# EAGLE schematic CANFD_HUB (EAGLE 9.6.2)
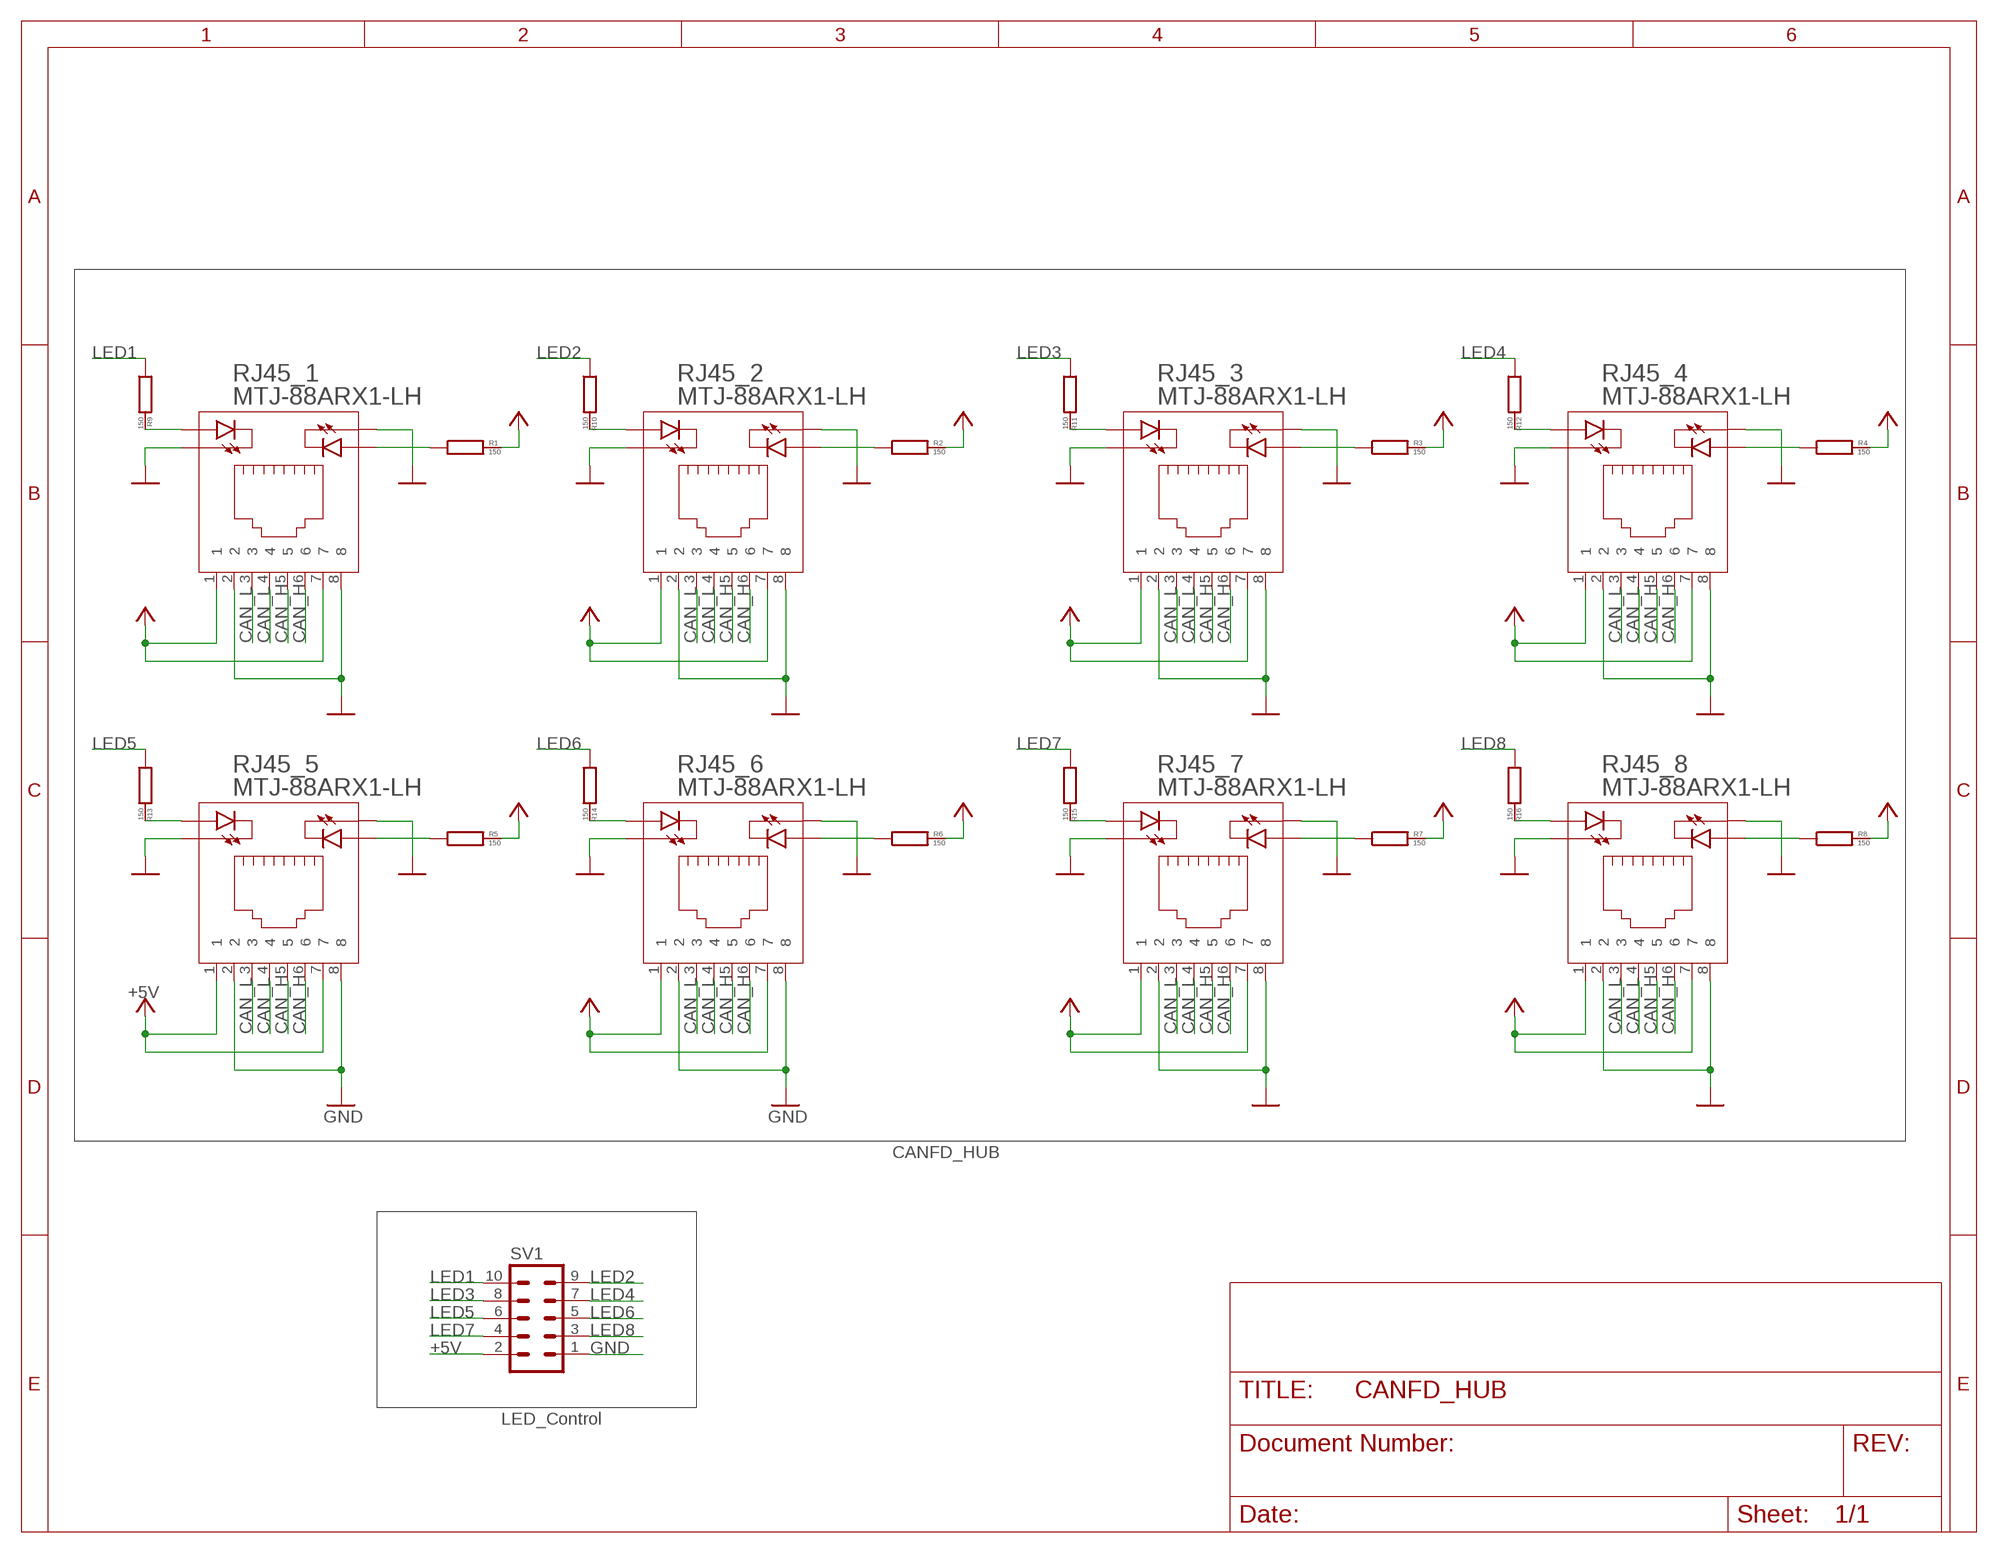
[diagram p0: schematic, sheet 1]

## Parts
R1  150  CR0603  [CR0603]
R2  150  CR0603  [CR0603]
R3  150  CR0603  [CR0603]
R4  150  CR0603  [CR0603]
R5  150  CR0603  [CR0603]
R6  150  CR0603  [CR0603]
R7  150  CR0603  [CR0603]
R8  150  CR0603  [CR0603]
R9  150  CR0603  [CR0603]
R10  150  CR0603  [CR0603]
R11  150  CR0603  [CR0603]
R12  150  CR0603  [CR0603]
R13  150  CR0603  [CR0603]
R14  150  CR0603  [CR0603]
R15  150  CR0603  [CR0603]
R16  150  CR0603  [CR0603]
RJ45_1  MTJ-88ARX1-LH  [MTJ-88ARX1-LH]
RJ45_2  MTJ-88ARX1-LH  [MTJ-88ARX1-LH]
RJ45_3  MTJ-88ARX1-LH  [MTJ-88ARX1-LH]
RJ45_4  MTJ-88ARX1-LH  [MTJ-88ARX1-LH]
RJ45_5  MTJ-88ARX1-LH  [MTJ-88ARX1-LH]
RJ45_6  MTJ-88ARX1-LH  [MTJ-88ARX1-LH]
RJ45_7  MTJ-88ARX1-LH  [MTJ-88ARX1-LH]
RJ45_8  MTJ-88ARX1-LH  [MTJ-88ARX1-LH]
SV1  ML10  [ML10]

## Nets
+5V: R1.RIGHT R2.RIGHT R3.RIGHT R4.RIGHT R5.RIGHT R6.RIGHT R7.RIGHT R8.RIGHT RJ45_1.1 RJ45_1.7 RJ45_2.1 RJ45_2.7 RJ45_3.1 RJ45_3.7 RJ45_4.1 RJ45_4.7 RJ45_5.1 RJ45_5.7 RJ45_6.1 RJ45_6.7 RJ45_7.1 RJ45_7.7 RJ45_8.1 RJ45_8.7 SV1.2
CAN_H: RJ45_1.5 RJ45_1.6 RJ45_2.5 RJ45_2.6 RJ45_3.5 RJ45_3.6 RJ45_4.5 RJ45_4.6 RJ45_5.5 RJ45_5.6 RJ45_6.5 RJ45_6.6 RJ45_7.5 RJ45_7.6 RJ45_8.5 RJ45_8.6
CAN_L: RJ45_1.3 RJ45_1.4 RJ45_2.3 RJ45_2.4 RJ45_3.3 RJ45_3.4 RJ45_4.3 RJ45_4.4 RJ45_5.3 RJ45_5.4 RJ45_6.3 RJ45_6.4 RJ45_7.3 RJ45_7.4 RJ45_8.3 RJ45_8.4
GND: RJ45_1.2 RJ45_1.8 RJ45_1.LED1_K RJ45_1.LED2_K RJ45_2.2 RJ45_2.8 RJ45_2.LED1_K RJ45_2.LED2_K RJ45_3.2 RJ45_3.8 RJ45_3.LED1_K RJ45_3.LED2_K RJ45_4.2 RJ45_4.8 RJ45_4.LED1_K RJ45_4.LED2_K RJ45_5.2 RJ45_5.8 RJ45_5.LED1_K RJ45_5.LED2_K RJ45_6.2 RJ45_6.8 RJ45_6.LED1_K RJ45_6.LED2_K RJ45_7.2 RJ45_7.8 RJ45_7.LED1_K RJ45_7.LED2_K RJ45_8.2 RJ45_8.8 RJ45_8.LED1_K RJ45_8.LED2_K SV1.1
LED1: R9.LEFT SV1.10
LED2: R10.LEFT SV1.9
LED3: R11.LEFT SV1.8
LED4: R12.LEFT SV1.7
LED5: R13.LEFT SV1.6
LED6: R14.LEFT SV1.5
LED7: R15.LEFT SV1.4
LED8: R16.LEFT SV1.3
N$1: R2.LEFT RJ45_2.LED2_A
N$2: R1.LEFT RJ45_1.LED2_A
N$3: R3.LEFT RJ45_3.LED2_A
N$4: R4.LEFT RJ45_4.LED2_A
N$5: R5.LEFT RJ45_5.LED2_A
N$6: R6.LEFT RJ45_6.LED2_A
N$7: R7.LEFT RJ45_7.LED2_A
N$8: R8.LEFT RJ45_8.LED2_A
N$9: R9.RIGHT RJ45_1.LED1_A
N$10: R10.RIGHT RJ45_2.LED1_A
N$11: R11.RIGHT RJ45_3.LED1_A
N$12: R12.RIGHT RJ45_4.LED1_A
N$13: R13.RIGHT RJ45_5.LED1_A
N$14: R14.RIGHT RJ45_6.LED1_A
N$15: R15.RIGHT RJ45_7.LED1_A
N$16: R16.RIGHT RJ45_8.LED1_A

## Notes on the sheet
- CANFD_HUB
- LED_Control

## Library data of the parts
R1-R16 = CR0603:CR0603
RJ45_1-RJ45_8 = MTJ-88ARX1-LH:MTJ-88ARX1-LH
SV1 = con-ml:ML10: HARTING; OC_FARNELL: unknown; OC_NEWARK: unknown